# EAGLE design LegoRpiHat (EAGLE 9.5.2)
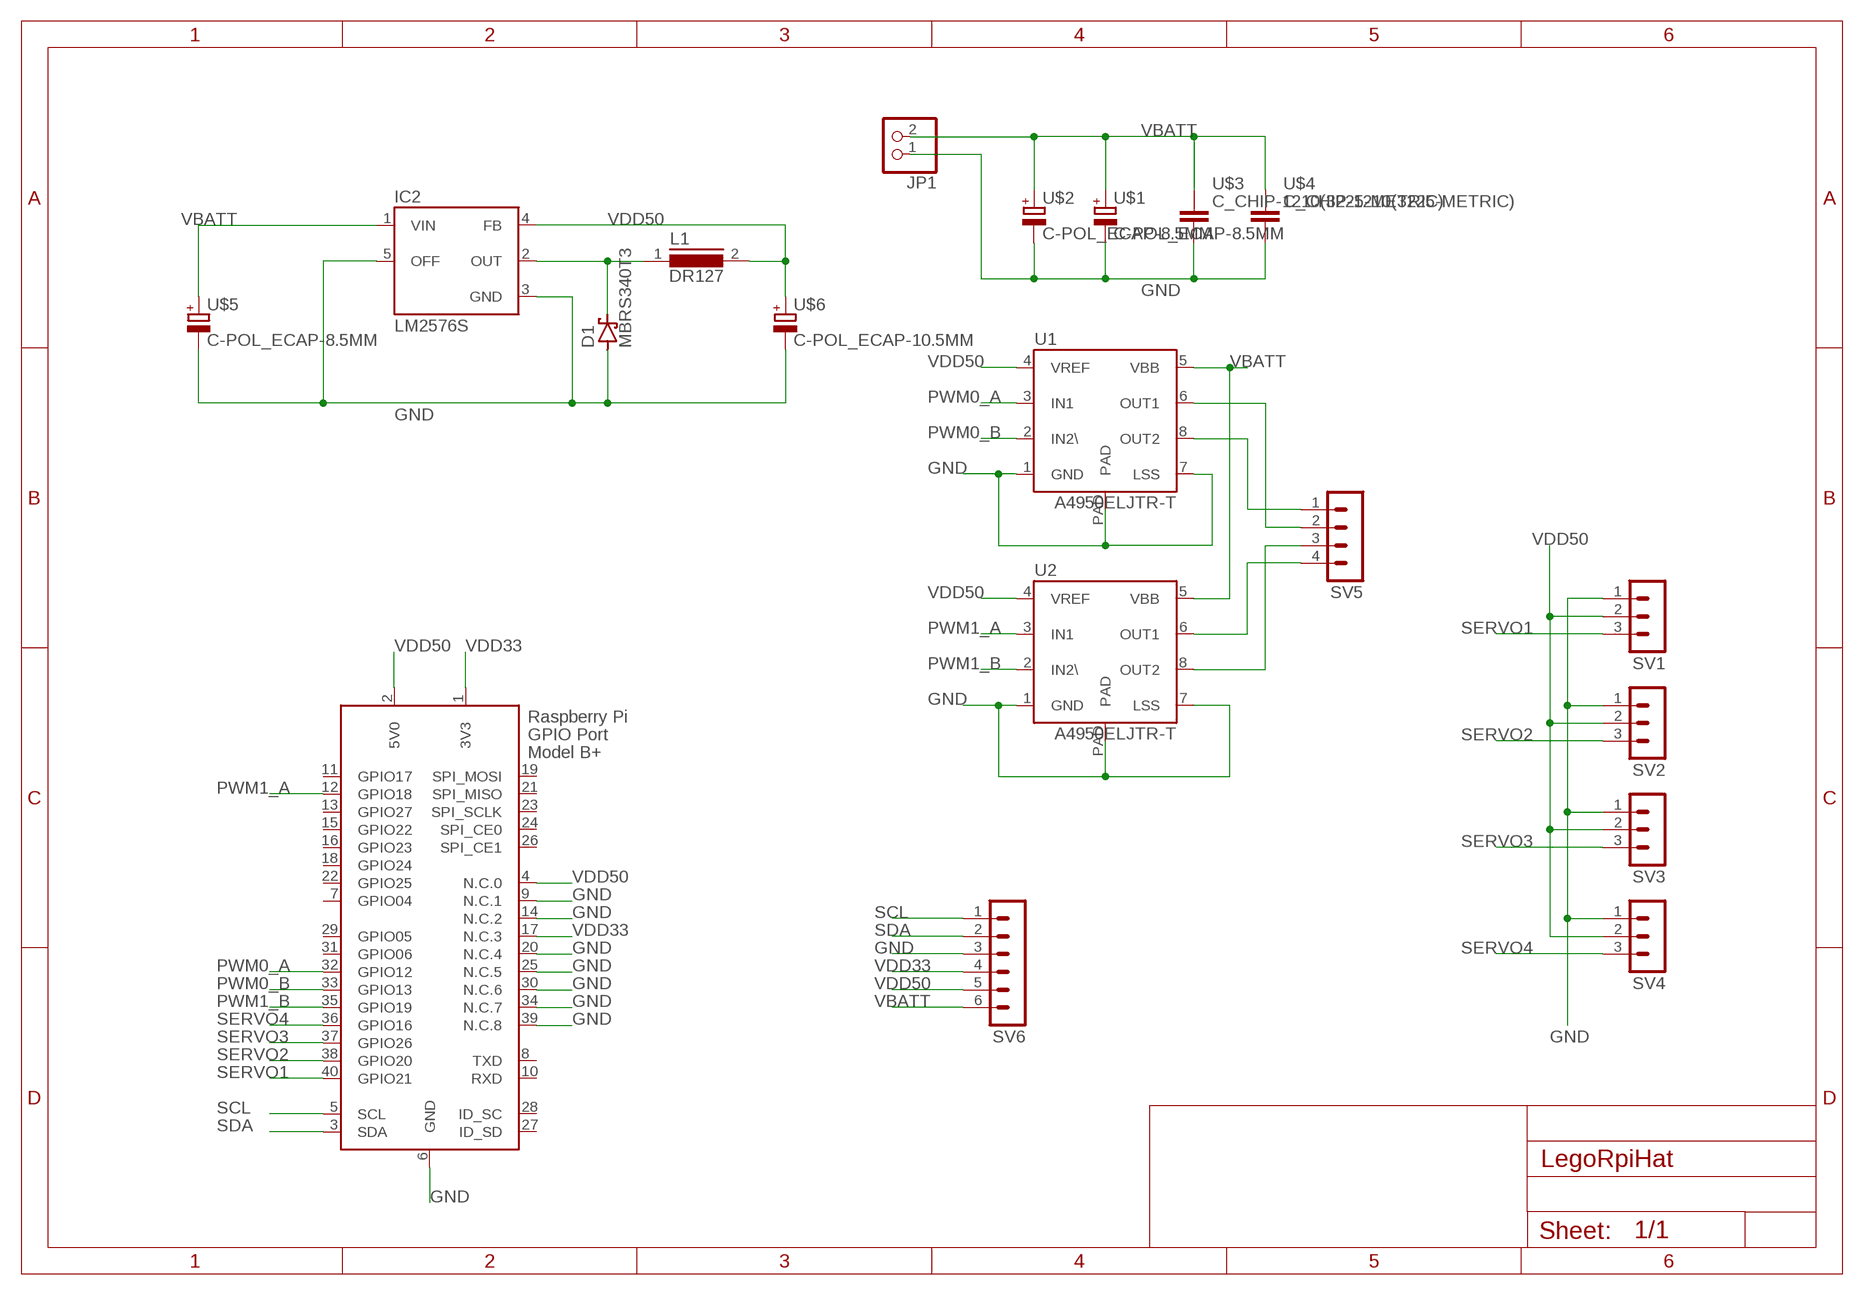
[diagram p0: schematic, sheet 1]

## Parts
D1  MBRS340T3  [SMC]
IC2  LM2576S  [TO263-5]
JP1  PINHD-1X2  [1X02]
L1  DR127  [DR127]
SV1  MA03-1  [MA03-1]
SV2  MA03-1  [MA03-1]
SV3  MA03-1  [MA03-1]
SV4  MA03-1  [MA03-1]
SV5  MA04-1  [MA04-1]
SV6  MA06-1  [MA06-1]
U1  A4950ELJTR-T  [SOIC8TP]
U2  A4950ELJTR-T  [SOIC8TP]
U$1  C-POL_ECAP-8.5MM  [CAPAE830X1050N]
U$2  C-POL_ECAP-8.5MM  [CAPAE830X1050N]
U$3  C_CHIP-1210(3225-METRIC)  [CAPC3225X135]
U$4  C_CHIP-1210(3225-METRIC)  [CAPC3225X135]
U$5  C-POL_ECAP-8.5MM  [CAPAE830X1050N]
U$6  C-POL_ECAP-10.5MM  [CAPAE1030X1050N]
X1  RASPI_BOARD_B+_H  [RASPI_BOARD_B+HAT]

## Nets
GND: D1.A IC2.3(GND) IC2.5(OFF) JP1.1 SV1.1 SV2.1 SV3.1 SV4.1 SV6.3 U1.1(GND) U1.7(LSS) U1.PAD U2.1(GND) U2.7(LSS) U2.PAD U$1.2(-) U$2.2(-) U$3.2 U$4.2 U$5.2(-) U$6.2(-) X1.6(GND) X1.9(N.C.1) X1.14(N.C.2) X1.20(N.C.4) X1.25(N.C.5) X1.30(N.C.6) X1.34(N.C.7) X1.39(N.C.8)
N$5: D1.C IC2.2(OUT) L1.1
N$9: SV5.2 U1.6(OUT1)
N$10: SV5.1 U1.8(OUT2)
N$11: SV5.4 U2.6(OUT1)
N$12: SV5.3 U2.8(OUT2)
PWM0_A: U1.3(IN1) X1.32(GPIO12)
PWM0_B: U1.2(IN2\) X1.33(GPIO13)
PWM1_A: U2.3(IN1) X1.12(GPIO18)
PWM1_B: U2.2(IN2\) X1.35(GPIO19)
SCL: SV6.1 X1.5(SCL)
SDA: SV6.2 X1.3(SDA)
SERVO1: SV1.3 X1.40(GPIO21)
SERVO2: SV2.3 X1.38(GPIO20)
SERVO3: SV3.3 X1.37(GPIO26)
SERVO4: SV4.3 X1.36(GPIO16)
VBATT: IC2.1(VIN) JP1.2 SV6.6 U1.5(VBB) U2.5(VBB) U$1.1(+) U$2.1(+) U$3.1 U$4.1 U$5.1(+)
VDD33: SV6.4 X1.1(3V3) X1.17(N.C.3)
VDD50: IC2.4(FB) L1.2 SV1.2 SV2.2 SV3.2 SV4.2 SV6.5 U1.4(VREF) U2.4(VREF) U$6.1(+) X1.2(5V0) X1.4(N.C.0)
Unconnected: X1.7(GPIO04) X1.8(TXD) X1.10(RXD) X1.11(GPIO17) X1.13(GPIO27) X1.15(GPIO22) X1.16(GPIO23) X1.18(GPIO24) X1.19(SPI_MOSI) X1.21(SPI_MISO) X1.22(GPIO25) X1.23(SPI_SCLK) X1.24(SPI_CE0) X1.26(SPI_CE1) X1.27(ID_SD) X1.28(ID_SC) X1.29(GPIO05) X1.31(GPIO06)

## Library data of the parts
D1 = diode:MBRS3*0T3: SCHOTTKY BARRIER RECTIFIER 3.0 AMPERES 20, 30, 40 VOLT Source: MBRS340T3-D.pdf
IC2 = v-reg-3:LM2576: National Semiconductor <http://www.national.com> 3.0A "Simple Switcher"(c) 52kHz, Vout 1.23-37V (HV: 57V), Vin 40V (HV: 60V), 50µA standby current
JP1 = pinhead:PINHD-1X2: PIN HEADER
L1 = inductors:DR127: High Power Density, High Efficiency, Shielded Inductors Source: coiltronics_dr_series.pdf; SPICEPREFIX: L
SV1-SV4 = con-lstb:MA03-1: PIN HEADER; OC_FARNELL: unknown; OC_NEWARK: unknown
SV5 = con-lstb:MA04-1: PIN HEADER; OC_FARNELL: unknown; OC_NEWARK: unknown
SV6 = con-lstb:MA06-1: PIN HEADER; OC_FARNELL: unknown; OC_NEWARK: unknown
U1 U2 = allegro:A4950ELJTR-T: IC MOTOR DRIVER PAR 8SOIC tested: YES (parallel gripper mcb)
U$1 U$2 U$5 U$6 = Capacitor:C-POL: Capacitor Polarised - Generic; CATEGORY: Capacitor
U$3 U$4 = Capacitor:C: Capacitor - Generic; CATEGORY: Capacitor
X1 = raspberrypi_bastelstube_v13:RASPI_BOARD_B+: Raspberry Pi GPIO connector with markings for the outer dimensions of the Raspberry Pi board model B+ with different sets of drill holes or mounting pads

## Net classes
0 default: clearance 0.205 mm

## Board
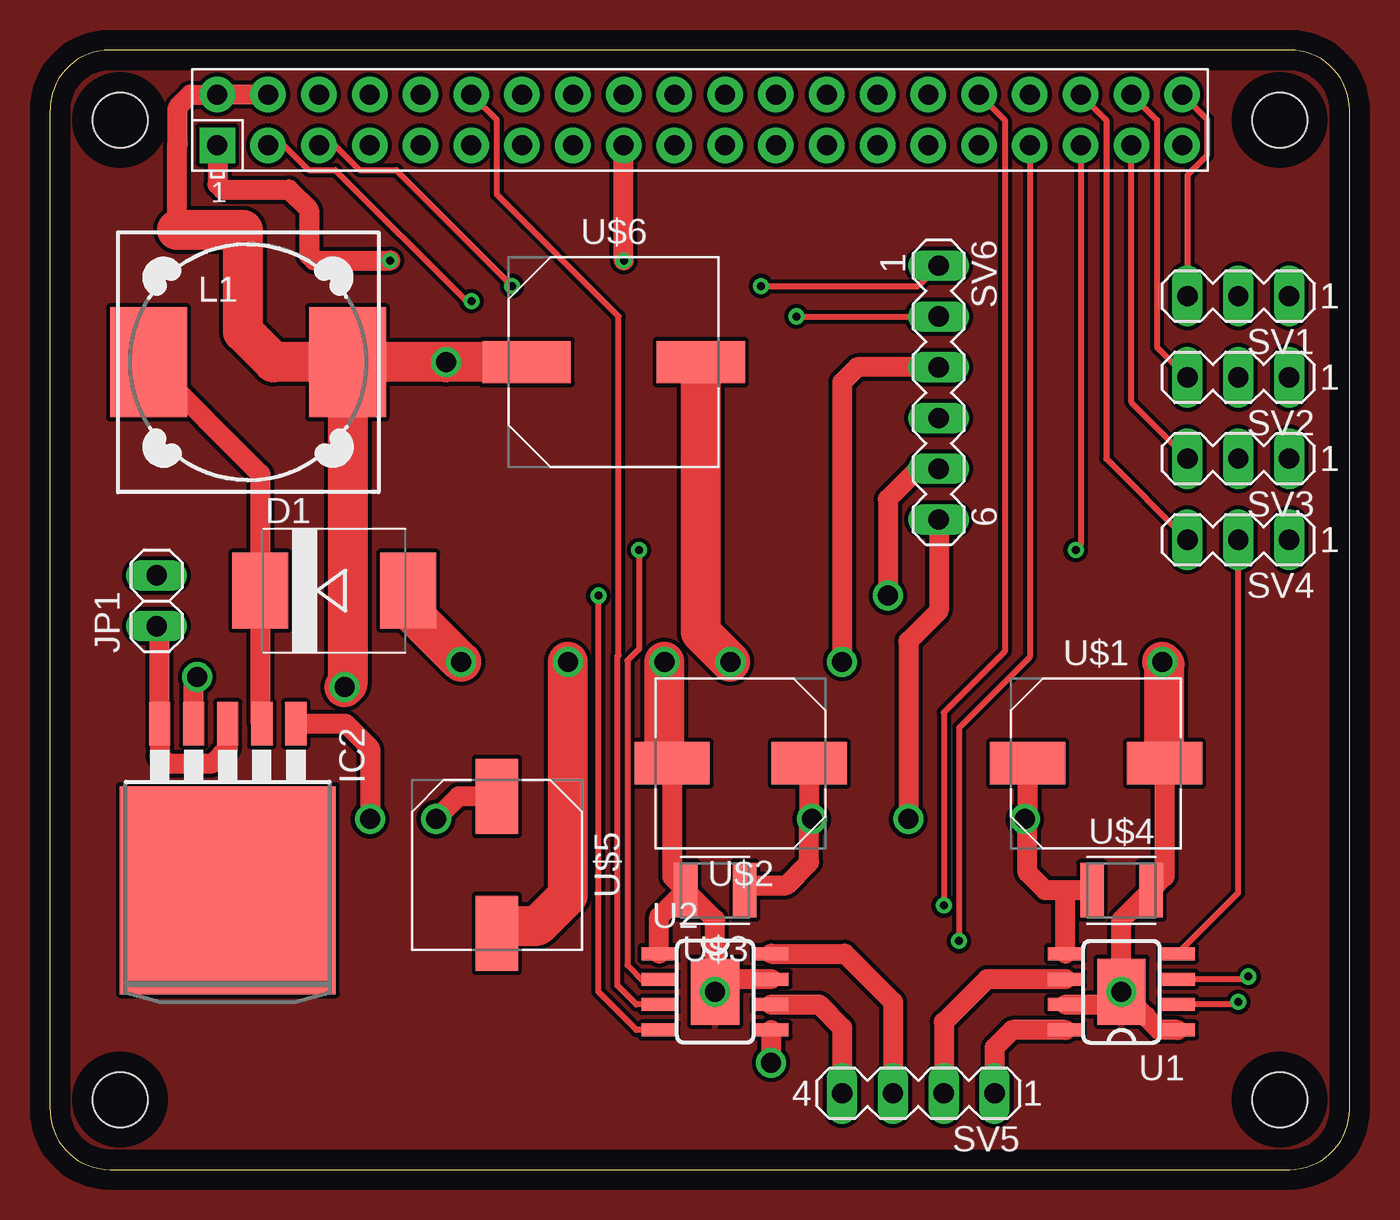
[diagram p1: board, top side]
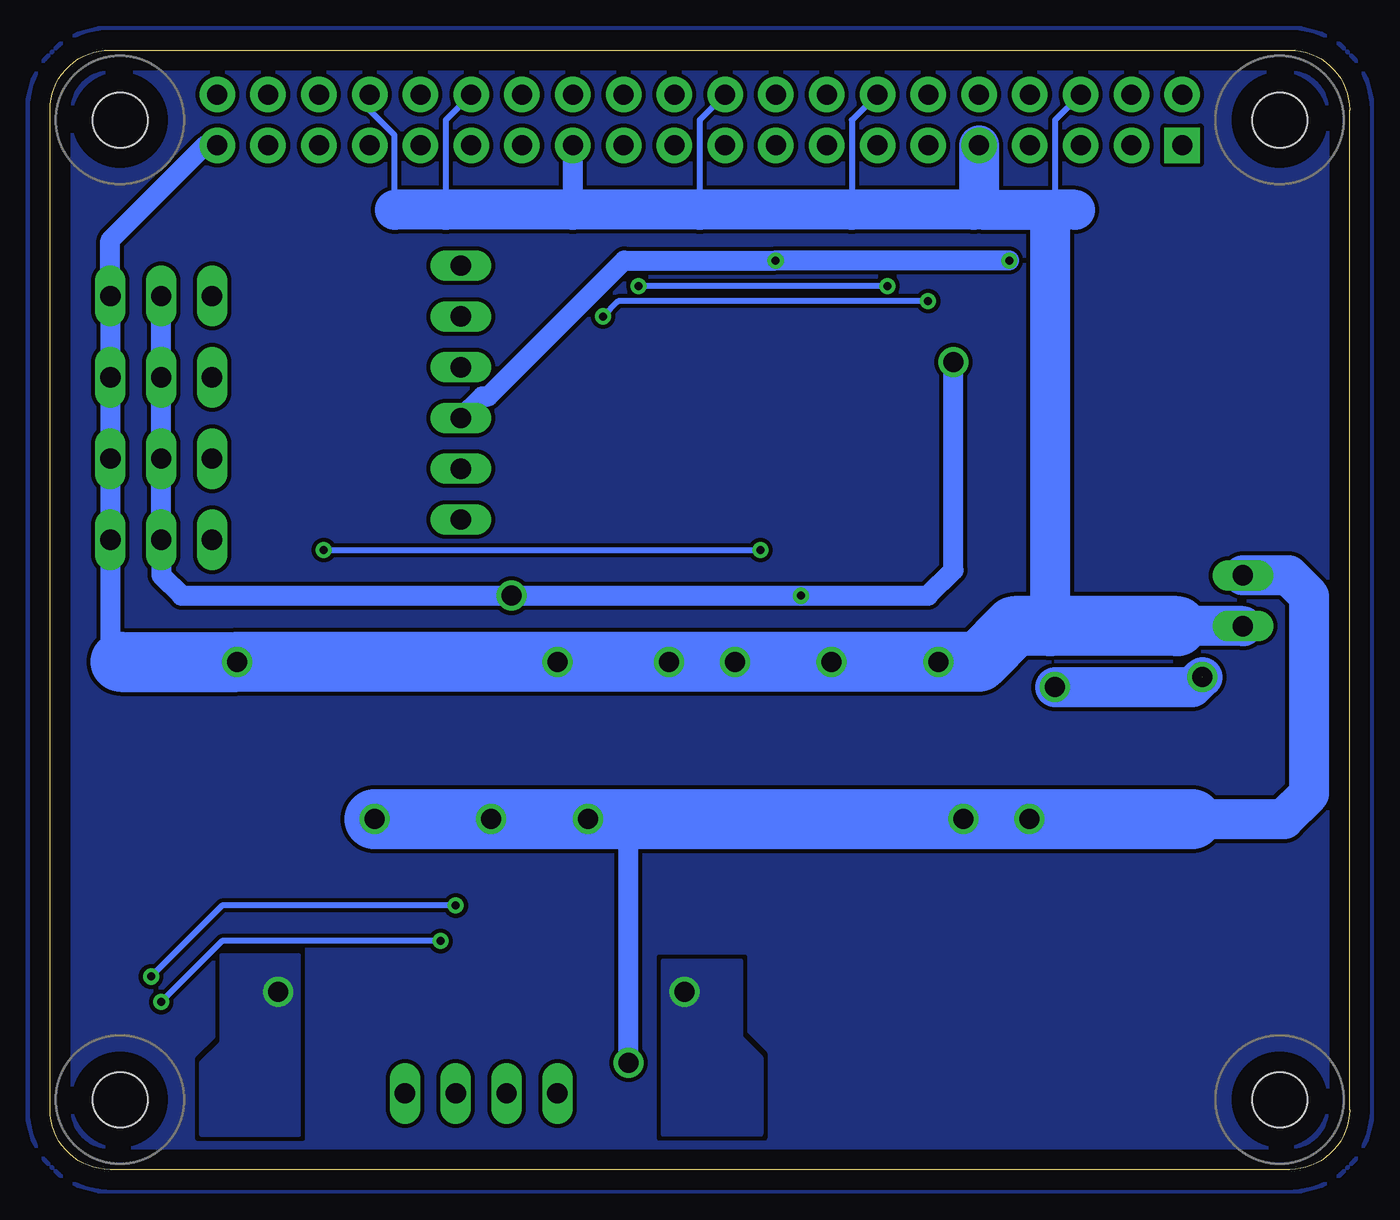
[diagram p2: board, bottom side, seen from below]

Size 65 x 56 mm. Coordinates in mm from the lower left corner, seen from the top.
Copper layers (1*16): Top 0.035mm / dielectric 1.5mm / Bottom 0.035mm
Design rules "LegoRpiHat": minimum track width 0.25mm, minimum drill 0.4mm, track to track 0.205mm, track to pad 0.205mm, pad to pad 0.205mm, via to via 0.205mm, smd to smd 0.2mm, copper to edge 40mil, drill to drill 6mil, minimum pad ring 10mil, minimum via ring 8mil, stop-mask expansion 4mil, vias tented up to drill 0mil, thermal gap 10mil

### Footprints (pad centres in the part's own frame; a part is rotated, then mirrored left to right if it is on the bottom)
SMC = smd 2.8 x 3.8: A 3.7,0; C -3.7,0
TO263-5 = smd 1.067 x 2.159: 1 -3.404,-5.791; 2 -1.702,-5.791; 3 0,-5.791; 4 1.702,-5.791; 5 3.404,-5.791 | smd 10.8 x 10.41: 6 0,2.54
1X02 = drill 1.016 long: 1 -1.27,0; 2 1.27,0
DR127 = smd 3.85 x 5.5: 1 -4.975,0; 2 4.975,0
MA03-1 = drill 1.016 long: 1 -2.54,0; 2 0,0; 3 2.54,0
MA04-1 = drill 1.016 long: 1 -3.81,0; 2 -1.27,0; 3 1.27,0; 4 3.81,0
MA06-1 = drill 1.016 long: 1 -6.35,0; 2 -3.81,0; 3 -1.27,0; 4 1.27,0; 5 3.81,0; 6 6.35,0
SOIC8TP = smd 1.75 x 0.65: 1 -2.8,1.905; 2 -2.8,0.635; 3 -2.8,-0.635; 4 -2.8,-1.905; 5 2.8,-1.905; 6 2.8,-0.635; 7 2.8,0.635; 8 2.8,1.905 | smd 2.41 x 3.3: PAD 0,0
CAPAE830X1050N = smd 3.764 x 2.115: 1 -3.426,0; 2 3.426,0
CAPC3225X135 = smd 1.165 x 2.715: 1 -1.475,0; 2 1.475,0
CAPAE1030X1050N = smd 4.416 x 2.115: 1 -4.353,0; 2 4.353,0
RASPI_BOARD_B+HAT = drill 1 pad 1.778 square: 1 8.37,51.23 | drill 1 pad 1.778: 2 8.37,53.77; 3 10.91,51.23; 4 10.91,53.77; 5 13.45,51.23; 6 13.45,53.77; 7 15.99,51.23; 8 15.99,53.77; 9 18.53,51.23; 10 18.53,53.77; 11 21.07,51.23; 12 21.07,53.77; 13 23.61,51.23; 14 23.61,53.77; 15 26.15,51.23; 16 26.15,53.77; 17 28.69,51.23; 18 28.69,53.77; 19 31.23,51.23; 20 31.23,53.77; 21 33.77,51.23; 22 33.77,53.77; 23 36.31,51.23; 24 36.31,53.77; 25 38.85,51.23; 26 38.85,53.77; 27 41.39,51.23; 28 41.39,53.77; 29 43.93,51.23; 30 43.93,53.77; 31 46.47,51.23; 32 46.47,53.77; 33 49.01,51.23; 34 49.01,53.77; 35 51.55,51.23; 36 51.55,53.77; 37 54.09,51.23; 38 54.09,53.77; 39 56.63,51.23; 40 56.63,53.77 | hole 2.75: 3.5,3.5; 3.5,52.5; 61.5,3.5; 61.5,52.5

### Placement (x,y rotation side)
D1  14.22,28.96 0 top
IC2  8.89,16.51 180 top
JP1  5.33,28.45 90 top
L1  9.91,40.39 0 top
SV1  59.44,43.69 180 top
SV2  59.44,39.62 180 top
SV3  59.44,35.56 180 top
SV4  59.44,31.5 180 top
SV5  43.43,3.81 180 top
SV6  44.45,38.86 270 top
U1  53.59,8.89 180 top
U2  33.27,8.89 0 top
U$1  52.32,20.32 0 top
U$2  34.54,20.32 180 top
U$3  33.27,13.97 180 top
U$4  53.59,13.97 0 top
U$5  22.35,15.24 270 top
U$6  28.19,40.39 0 top
X1  0,0 0 top

### Tracks (layer width: path | path; a pad name or v marks a point on that pad's centre or on a via)
_OUTLINES_
  pour Bottom (rank 6, no thermals): -1.12,2.46 -0.84,1.41 -0.29,0.47 0.47,-0.29 0.47,-0.29 0.47,-0.29 1.41,-0.84 1.41,-0.84 2.46,-1.12 62.54,-1.12 63.59,-0.84 63.59,-0.84 64.53,-0.29 64.53,-0.29 65.29,0.47 65.29,0.47 65.84,1.41 65.84,1.41 66.12,2.46 66.12,53.54 65.84,54.59 65.84,54.59 65.29,55.53 65.29,55.53 64.53,56.29 64.53,56.29 63.59,56.84 63.59,56.84 62.54,57.12 2.46,57.12 1.41,56.84 1.41,56.84 0.47,56.29 0.47,56.29 -0.29,55.53 -0.29,55.53 -0.84,54.59 -0.84,54.59 -1.12,53.54 -1.12,2.78
GND  (via drill 1)
  Top 1: JP1.1 5.49,27.03 IC2.5 5.49,20.68 5.84,20.32 8.13,20.32 8.89,21.08 IC2.3 | U$1.2 55.75,14.65 U$4.2 53.59,12.49 U1.PAD | U$2.2 31.12,14.65 U$3.2 | U2.1 30.47,12.64 U$3.2 | U$3.2 33.27,12.49 U2.PAD 33.91,9.53 U2.7 | U1.PAD 54.82,7.67 54.82,7.64 55.47,6.99 U1.1 | U1.7 52.96,8.26 U1.PAD | SV6.3 40.39,40.13 39.62,39.37 v39.62,25.4
  Top 2: D1.A 17.92,28.05 v20.57,25.4 | U$2.2 30.73,20.7 v30.73,25.4 | U$1.2 55.75,25.28 v55.63,25.4 | U$5.2 22.73,12.19 24.38,12.19 25.91,13.72 v25.91,25.4 | U$6.2 32.55,26.89 v34.04,25.4
  Bottom 0.3: X1.34 49.01,52.98 47.77,51.74 47.77,48.02 47.75,48.01 | X1.30 45.21,52.49 45.21,48.01 | X1.20 32.51,52.49 32.51,48.01 | X1.14 24.89,52.49 24.89,48.01 | X1.6 14.73,52.49 14.73,48.01
  Bottom 1: 61.47,25.4 61.98,25.91 SV4.1 SV3.1 SV2.1 SV1.1 61.98,46.48 57.23,51.23 X1.39 | X1.25 38.86,51.22 38.86,48.01
  Bottom 2: JP1.1 8.64,27.18 | X1.9 18.53,48.27 | 18.53,48.27 18.26,48.01 14.73,48.01 | 13.72,48.01 14.73,48.01 | 18.53,48.27 18.8,48.01 24.89,48.01 32.51,48.01 38.86,48.01 45.21,48.01 47.75,48.01 | 14.73,48.01 14.99,47.75 14.99,27.18
  Bottom 3: 8.64,27.18 14.99,27.18 16.76,27.18 18.54,25.4 v20.57,25.4 v25.91,25.4 v30.73,25.4 v34.04,25.4 v39.62,25.4 v55.63,25.4 61.47,25.4
  other vias: 33.27,8.89 53.59,8.89
  pour Top: 32.51,7.37 32.51,6.35 31.75,5.59 29.72,5.59 29.72,1.78 33.53,1.78 34.04,2.29 34.04,7.37
  pour Top: 52.83,7.37 52.83,2.03 53.09,1.78 57.4,1.78 57.4,5.33 55.37,5.33 54.86,5.33 54.36,5.84 54.36,7.37
  pour Bottom: 34.29,10.41 30.48,10.41 30.48,6.6 29.46,5.59 29.46,1.78 34.29,1.78
  pour Bottom: 52.58,10.67 56.39,10.67 56.39,6.35 57.4,5.33 57.4,1.78 52.58,1.78
N$5
  Top 1: L1.1 10.52,34.79 D1.C 10.52,22.37 IC2.2
N$9
  Top 1: U1.6 46.86,9.53 44.7,7.37 SV5.2
N$10
  Top 1: U1.8 48.13,6.99 47.24,6.1 SV5.1
N$11
  Top 1: U2.6 38.48,8.26 39.62,7.11 SV5.4
N$12
  Top 1: U2.8 39.75,10.79 42.16,8.38 SV5.3
PWM0_A  (via drill 0.4)
  Top 0.3: X1.32 47.75,52.49 47.75,25.91 44.7,22.86 v44.7,13.21 | v59.94,9.65 59.82,9.53 U1.3
  Bottom 0.3: v44.7,13.21 56.39,13.21 v59.94,9.65
PWM0_B  (via drill 0.4)
  Top 0.3: X1.33 49.01,25.64 45.47,22.1 v45.47,11.43 | v59.44,8.38 59.31,8.26 U1.2
  Bottom 0.3: v45.47,11.43 56.39,11.43 v59.44,8.38
PWM1_A
  Top 0.3: U2.3 29.34,8.26 28.39,9.21 28.39,25.67 28.45,25.73 28.45,42.67 22.35,48.77 22.35,52.49 X1.12
PWM1_B  (via drill 0.4)
  Top 0.3: X1.35 51.55,31.23 v51.31,30.99 | v29.46,30.99 29.46,26.04 28.89,25.46 28.89,10.23 29.72,9.4 30.35,9.4 U2.2
  Bottom 0.3: v51.31,30.99 v29.46,30.99
SCL  (via drill 0.4)
  Top 0.3: X1.5 14.24,51.23 15.48,49.99 17.32,49.99 v23.11,44.2 | v35.56,44.2 43.43,44.2 SV6.1
  Bottom 0.3: v23.11,44.2 v35.56,44.2
SDA  (via drill 0.4)
  Top 0.3: X1.3 11.7,51.23 12.94,49.99 14.27,49.99 20.83,43.43 v21.08,43.43 | v37.34,42.67 SV6.2
  Bottom 0.3: v21.08,43.43 36.58,43.43 v37.34,42.67
SERVO1
  Top 0.3: SV1.3 56.9,49.74 57.87,50.72 57.87,52.53 X1.40
SERVO2
  Top 0.3: X1.38 55.37,52.49 55.37,41.15 SV2.3
SERVO3
  Top 0.3: SV3.3 54.09,38.37 X1.37
SERVO4
  Top 0.3: X1.36 52.83,52.49 52.83,35.56 SV4.3
VBATT  (via drill 1)
  Top 1: U$1.1 48.9,17.66 | 48.9,17.66 v48.77,17.53 | U$4.1 50.8,13.97 | 50.8,13.97 49.78,13.97 48.9,14.86 48.9,17.66 | U$2.1 37.97,17.66 | 37.97,17.66 v38.1,17.53 | U$3.1 35,14.22 36.83,14.22 37.97,15.36 37.97,17.66 | U$5.1 20.44,18.67 v19.3,17.53 | IC2.1 14.78,22.3 16,21.08 v16,17.53 | U1.5 50.79,13.96 50.8,13.97 | U2.5 v36.07,5.34 v36.07,5.33 | SV6.6 44.45,27.94 42.93,26.42 v42.93,17.53
  Bottom 1: v36.07,5.33 36.07,17.53
  Bottom 2: 7.87,17.53 3.29,17.53 2.02,18.8 2.02,28.69 3.05,29.72 JP1.2
  Bottom 3: v48.77,17.53 v42.93,17.53 v38.1,17.53 36.07,17.53 v19.3,17.53 v16,17.53 7.87,17.53
VDD33  (via drill 0.4)
  Top 1: X1.1 8.38,51.22 8.38,49.28 8.64,49.02 11.94,49.02 12.95,48.01 12.95,45.72 13.21,45.47 v17.02,45.47 | v28.7,45.47 v28.69,45.48 X1.17
  Bottom 1: v17.02,45.47 27.94,45.47 v28.7,45.47 36.29,45.47 43.08,38.67 43.37,38.67 SV6.4
VDD50  (via drill 0.4, 1)  (1 unrouted)
  Top 0.3: U2.4 29.34,6.99 27.43,8.89 v27.43,28.7 | U1.4 59.44,13.84 SV4.2
  Top 1: X1.4 X1.2 7.03,53.77 6.39,53.13 6.39,51.3 6.35,51.26 6.35,46.99 | IC2.4 7.19,24.46 v7.37,24.64 | SV6.5 43.43,35.05 41.91,33.53 v41.91,28.7
  Top 2: U$6.1 v19.81,40.39 L1.2 | L1.2 14.88,24.28 v14.73,24.13 | L1.2 11.18,40.39 9.65,41.91 9.65,46.99 6.35,46.99
  Bottom 1: SV1.2 SV2.2 SV3.2 SV4.2 59.44,29.72 58.42,28.7 v41.91,28.7 v27.43,28.7 21.08,28.7 19.81,29.97 v19.81,40.39
  Bottom 2: v14.73,24.13 7.87,24.13 v7.36,24.63
~_REAL_OUTLINEMILL_~
  pour Top (no thermals): -13.45,-13.45 78.54,-13.45 78.54,68.43 -13.45,68.43